# EAGLE schematic SEMAFORO (EAGLE 7.3.0)
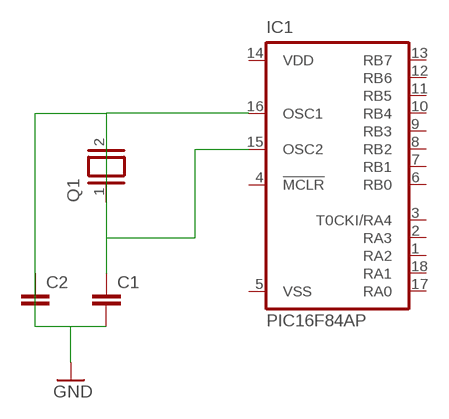
[diagram p0: schematic, sheet 1]

## Parts
C1  C2.5/2  [C2.5-2]
C2  C2.5/2  [C2.5-2]
IC1  PIC16F84AP  [DIL18]
Q1  XTAL/S  [QS]

## Nets
GND: C1.1 C1.2 C2.1 C2.2 IC1.15(OSC2) IC1.16(OSC1) Q1.1 Q1.2
Unconnected: IC1.1(RA2) IC1.2(RA3) IC1.3(T0CKI/RA4) IC1.4(!MCLR) IC1.6(RB0) IC1.7(RB1) IC1.8(RB2) IC1.9(RB3) IC1.10(RB4) IC1.11(RB5) IC1.12(RB6) IC1.13(RB7) IC1.17(RA0) IC1.18(RA1)

## Power pins joined to a net without a drawn wire
VDD: IC1.14(VDD)
VSS: IC1.5(VSS)

## Library data of the parts
C1 C2 = capacitor-wima:C: CAPACITOR naming: grid - package width
IC1 = microchip:PIC16F8*: MICROCONTROLLER 8-Bit PIC16F8X Family - CMOS Flash/EEPROM Pin Compatible : PIC16F83, PIC16CR83, PIC16F84A, PIC16CR84 see also PIC16C* <DEVICE:PIC16C*>; MF: MICROCHIP; MPN: PIC16F84A-04I/P; OC_FARNELL: 9760865; OC_NEWARK: 69K7635
Q1 = special:XTAL/S: CRYSTAL